# Altium schematic sheet Sheet1.SchDoc
size A4
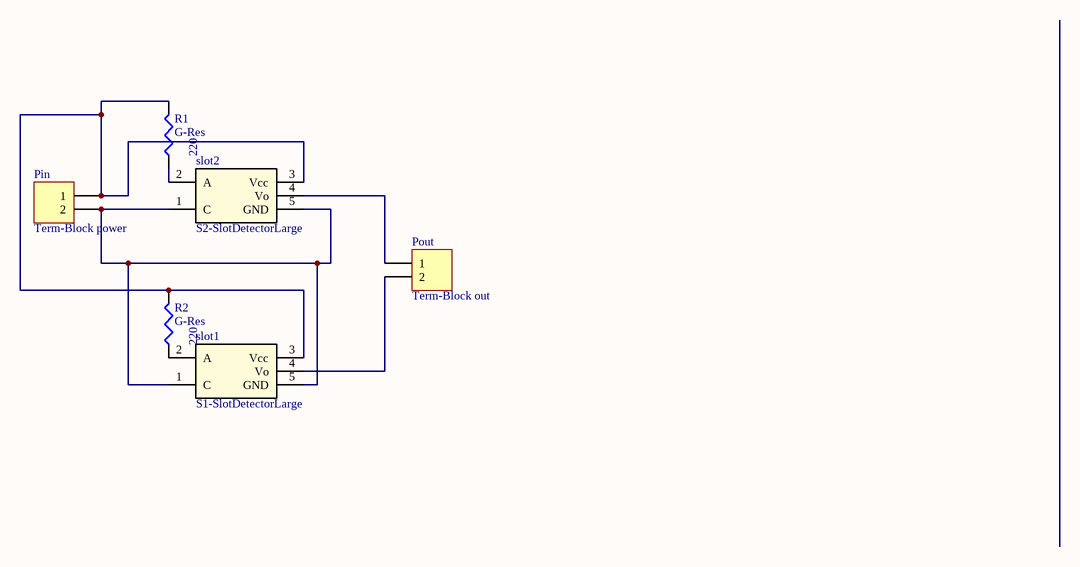
[diagram p0: Sheet1.SchDoc]

## Parts
Pin  Term-Block power  [TERM-BLOCK-5.08MM-2POS]
Pout  Term-Block out  [TERM-BLOCK-5.08MM-2POS]
R1  G-Res  value 220  [Res10mm_LGE1.0]
R2  G-Res  value 220  [Res10mm_LGE1.0]
slot1  S1-SlotDetectorLarge  [S-SLot3]
slot2  S2-SlotDetectorLarge  [S-SLot3]

## Nets
NetPin_1: Pin.1 R1.2 R2.2 slot1.3(Vcc) slot2.3(Vcc)
NetPin_2: Pin.2 slot1.1(C) slot1.5(GND) slot2.1(C) slot2.5(GND)
NetPout_1: Pout.1 slot2.4(Vo)
NetPout_2: Pout.2 slot1.4(Vo)
NetR1_1: R1.1 slot2.2(A)
NetR2_1: R2.1 slot1.2(A)

## Library data of the parts
Pin Pout = C-Block2: Terminal-Block 1x2; LatestRevisionDate: 17-Jul-2002; LatestRevisionNote: Re-released for DXP Platform.; Publisher: Altium Limited
R1 R2 = G-Res: Resistor (specify value); Published: 8-Jun-2000; LatestRevisionDate: 29-May-2009; LatestRevisionNote: IPC-7351 Footprint Added.; PackageReference: J1-0603; Publisher: Altium Limited; PackageDescription: Chip Resistor
slot1 = S2-SlotDetectorLarge